# Altium schematic sheet Sensors.SchDoc
size A4
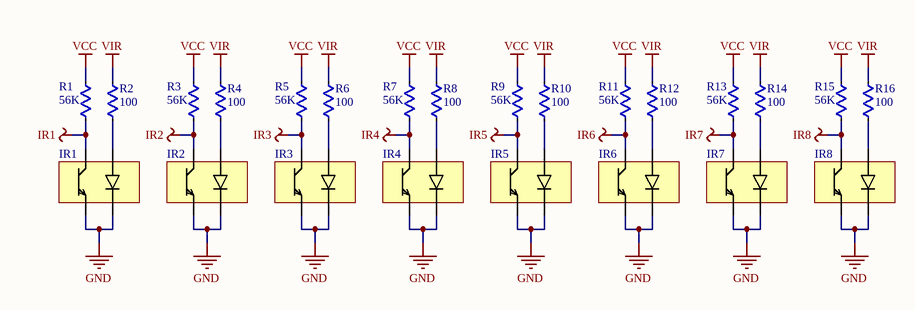
[diagram p0: Sensors.SchDoc]

## Parts
IR1  QRE1113GR  [QRE1113GR]  (value not drawn)
IR2  QRE1113GR  [QRE1113GR]  (value not drawn)
IR3  QRE1113GR  [QRE1113GR]  (value not drawn)
IR4  QRE1113GR  [QRE1113GR]  (value not drawn)
IR5  QRE1113GR  [QRE1113GR]  (value not drawn)
IR6  QRE1113GR  [QRE1113GR]  (value not drawn)
IR7  QRE1113GR  [QRE1113GR]  (value not drawn)
IR8  QRE1113GR  [QRE1113GR]  (value not drawn)
R1  value 56K  [R1206]  (hidden comment: RES)
R2  value 100  [R1206]  (hidden comment: RES)
R3  value 56K  [R1206]  (hidden comment: RES)
R4  value 100  [R1206]  (hidden comment: RES)
R5  value 56K  [R1206]  (hidden comment: RES)
R6  value 100  [R1206]  (hidden comment: RES)
R7  value 56K  [R1206]  (hidden comment: RES)
R8  value 100  [R1206]  (hidden comment: RES)
R9  value 56K  [R1206]  (hidden comment: RES)
R10  value 100  [R1206]  (hidden comment: RES)
R11  value 56K  [R1206]  (hidden comment: RES)
R12  value 100  [R1206]  (hidden comment: RES)
R13  value 56K  [R1206]  (hidden comment: RES)
R14  value 100  [R1206]  (hidden comment: RES)
R15  value 56K  [R1206]  (hidden comment: RES)
R16  value 100  [R1206]  (hidden comment: RES)

## Nets
GND: IR1.E IR1.K IR2.E IR2.K IR3.E IR3.K IR4.E IR4.K IR5.E IR5.K IR6.E IR6.K IR7.E IR7.K IR8.E IR8.K
IR1: IR1.C R1.1
IR2: IR2.C R3.1
IR3: IR3.C R5.1
IR4: IR4.C R7.1
IR5: IR5.C R9.1
IR6: IR6.C R11.1
IR7: IR7.C R13.1
IR8: IR8.C R15.1
VCC: R1.2 R3.2 R5.2 R7.2 R9.2 R11.2 R13.2 R15.2
VIR: R2.2 R4.2 R6.2 R8.2 R10.2 R12.2 R14.2 R16.2
NetIR1_A: IR1.A R2.1
NetIR2_A: IR2.A R4.1
NetIR3_A: IR3.A R6.1
NetIR4_A: IR4.A R8.1
NetIR5_A: IR5.A R10.1
NetIR6_A: IR6.A R12.1
NetIR7_A: IR7.A R14.1
NetIR8_A: IR8.A R16.1

## Library data of the parts
IR1-IR8 = QRE1113GR: MF: ON Semiconductor; Price: 0.46 USD; MP: QRE1113GR; Package: SMD-4 ON Semiconductor; Availability: Good; Value: *